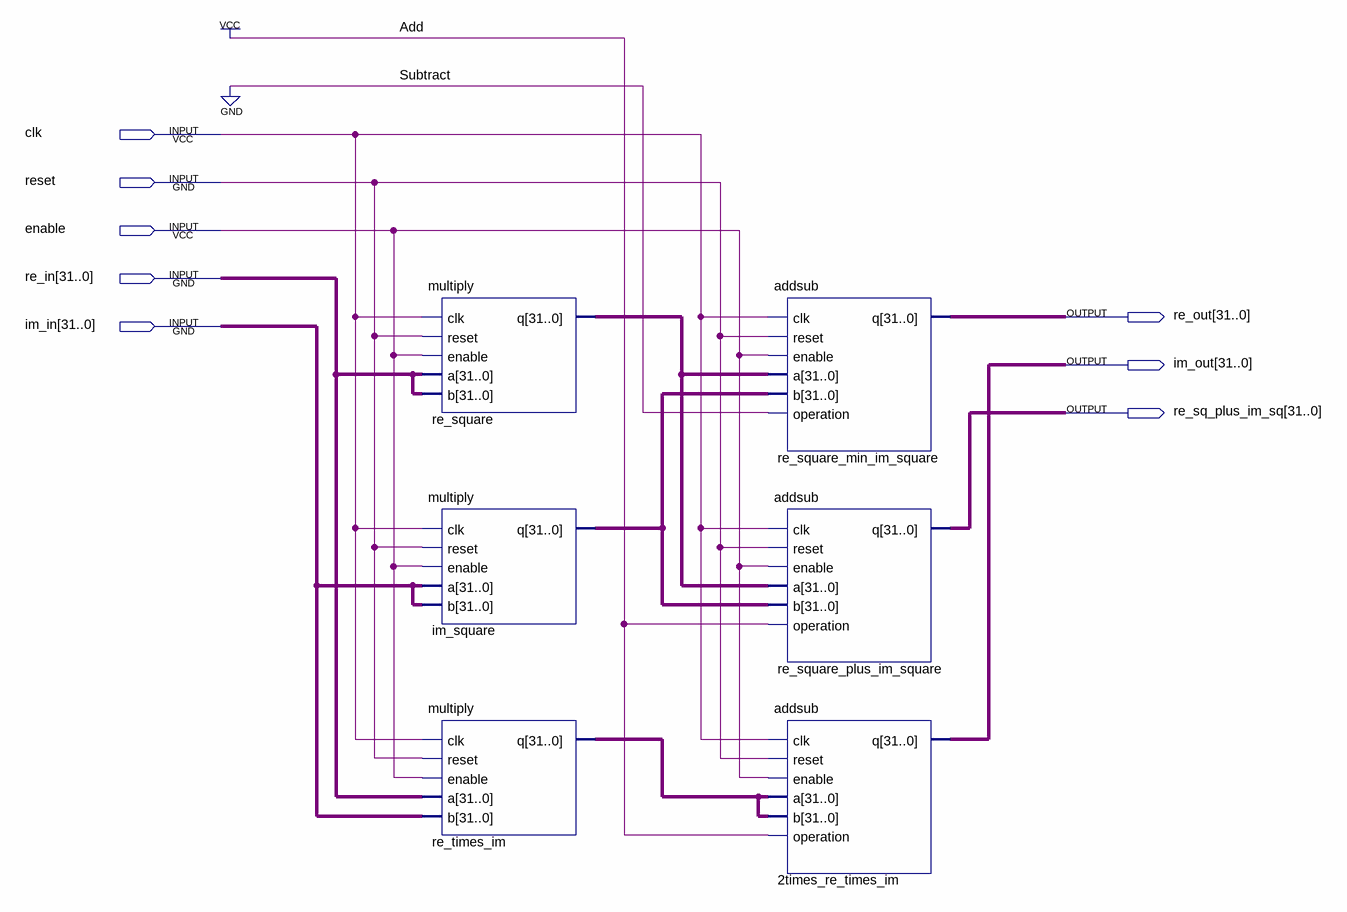
[diagram p0: schematic sheet]
// Quartus schematic complex_square.bdf as structural Verilog: 6 symbols, 8 pins
module complex_square (
  input  clk,
  input  reset,
  input  enable,
  input  [31:0] re_in,
  input  [31:0] im_in,
  output [31:0] re_out,
  output [31:0] im_out,
  output [31:0] re_sq_plus_im_sq
);

  wire [31:0] im_square_q, re_square_q, re_times_im_q;

  multiply re_square (.clk(clk), .reset(reset), .enable(enable), .a(re_in), .b(re_in), .q(re_square_q));
  multiply im_square (.clk(clk), .reset(reset), .enable(enable), .a(im_in), .b(im_in), .q(im_square_q));
  multiply re_times_im (.clk(clk), .reset(reset), .enable(enable), .a(re_in), .b(im_in), .q(re_times_im_q));
  addsub re_square_min_im_square (
    .clk(clk), .reset(reset), .enable(enable), .a(re_square_q), .b(im_square_q), .operation(1'b0), .q(re_out));
  addsub re_square_plus_im_square (
    .clk(clk), .reset(reset), .enable(enable), .a(re_square_q), .b(im_square_q), .operation(1'b1),
    .q(re_sq_plus_im_sq));
  addsub u_2times_re_times_im (
    .clk(clk), .reset(reset), .enable(enable), .a(re_times_im_q), .b(re_times_im_q), .operation(1'b1),
    .q(im_out));
endmodule
